# EasyEDA schematic FuseBlock.json
TITLE: Sheet_1; REV: 1.0; Date: 2024-11-07; Sheet: 1/1; Company: Your Company
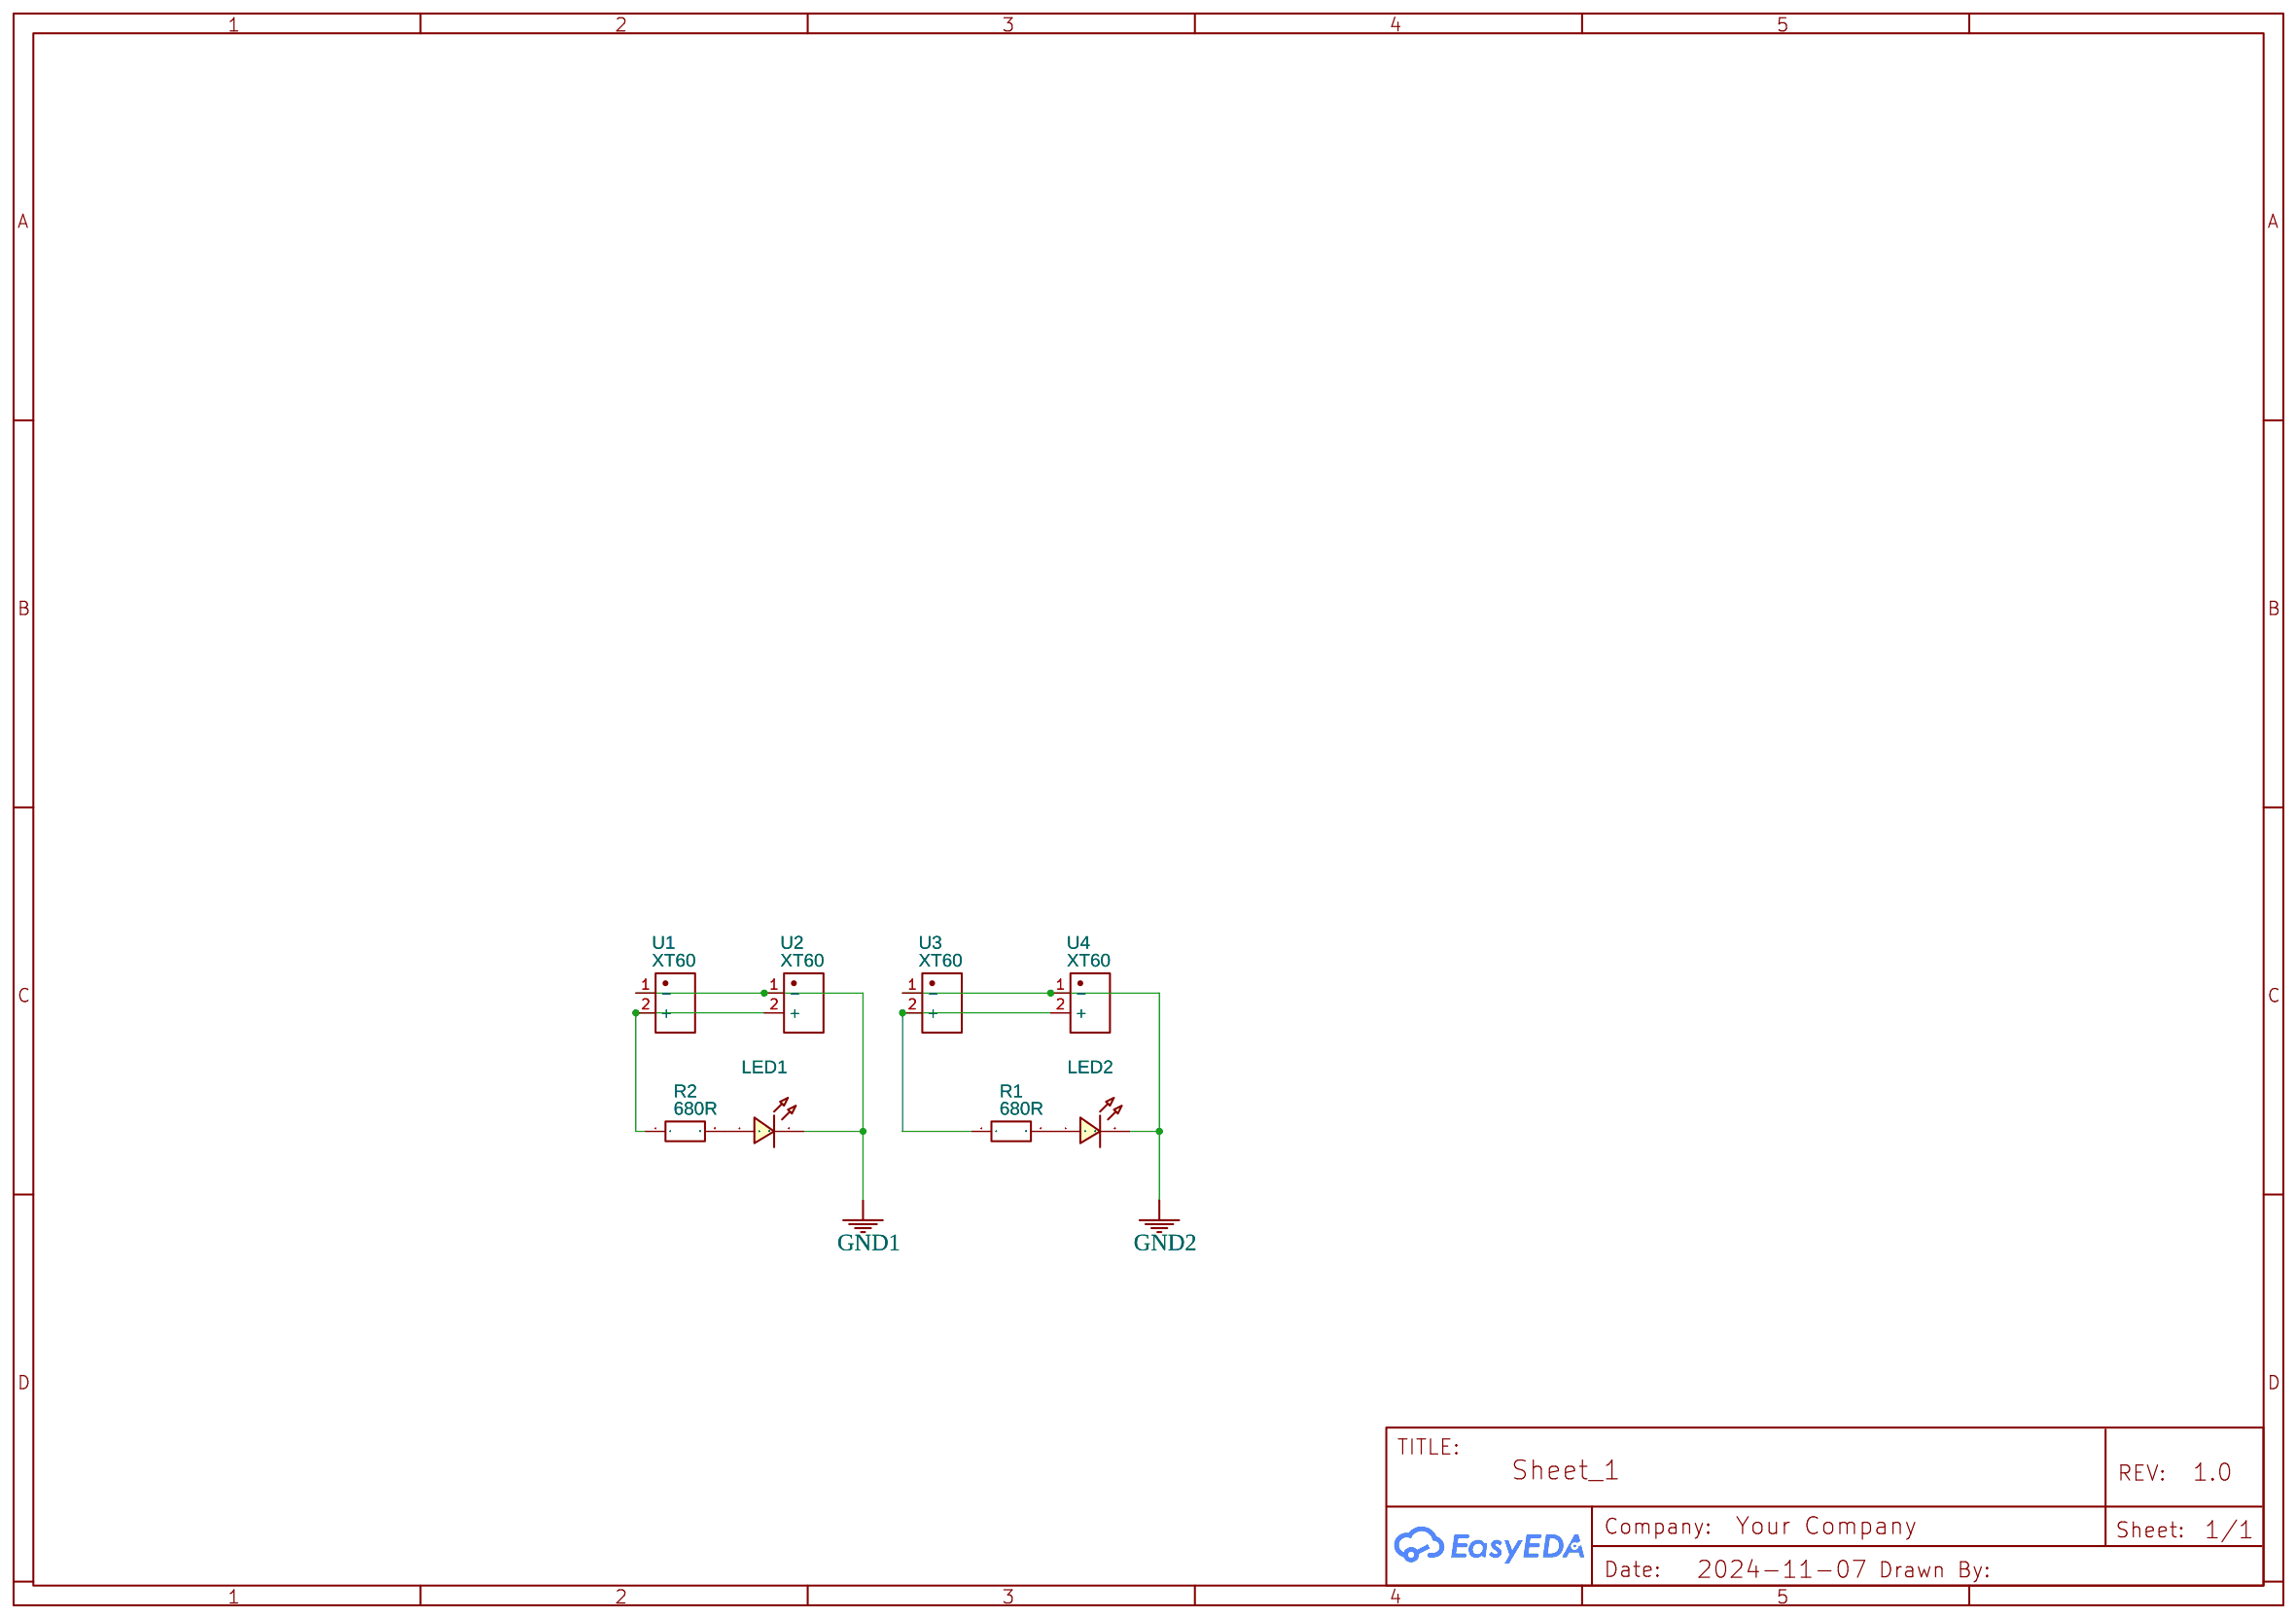
[diagram p0: schematic sheet]

## Parts
LED1  LED-0603_R  [LED0603_RED]
LED2  LED-0603_R  [LED0603_RED]
R1  680R  [R0603]
R2  680R  [R0603]
U1  XT60  [CONN-TH_XT60]
U2  XT60  [CONN-TH_XT60]
U3  XT60  [CONN-TH_XT60]
U4  XT60  [CONN-TH_XT60]

## Library data of the parts
LED1 LED2 = LED-0603_R: Manufacturer: EVERLIGHT(台湾亿光); Manufacturer Part: 19-217/R6C-AL1M2VY/3T; Supplier Part: C72044; Supplier: LCSC; Contributor: LCEDA_01
R1 R2 = R_0603_EU: Contributor: LCEDA_Lib
U1-U4 = XT60: Contributor: lcsc; Supplier: LCSC; Supplier Part: C98733; Manufacturer: AMASS(艾迈斯); JLCPCB Part Class: Extended Part

## Nets
GND1: LED1.2 U1.1(-) U2.1(-)
GND2: LED2.2 U3.1(-) U4.1(-)
Net-(LED1-1): LED1.1 R2.2
Net-(LED2-1): LED2.1 R1.2
Net-(R1-1): R1.1 U3.2(+) U4.2(+)
Net-(R2-1): R2.1 U1.2(+) U2.2(+)
